# Altium schematic sheet projet_pcb_F103.SchDoc
size A3
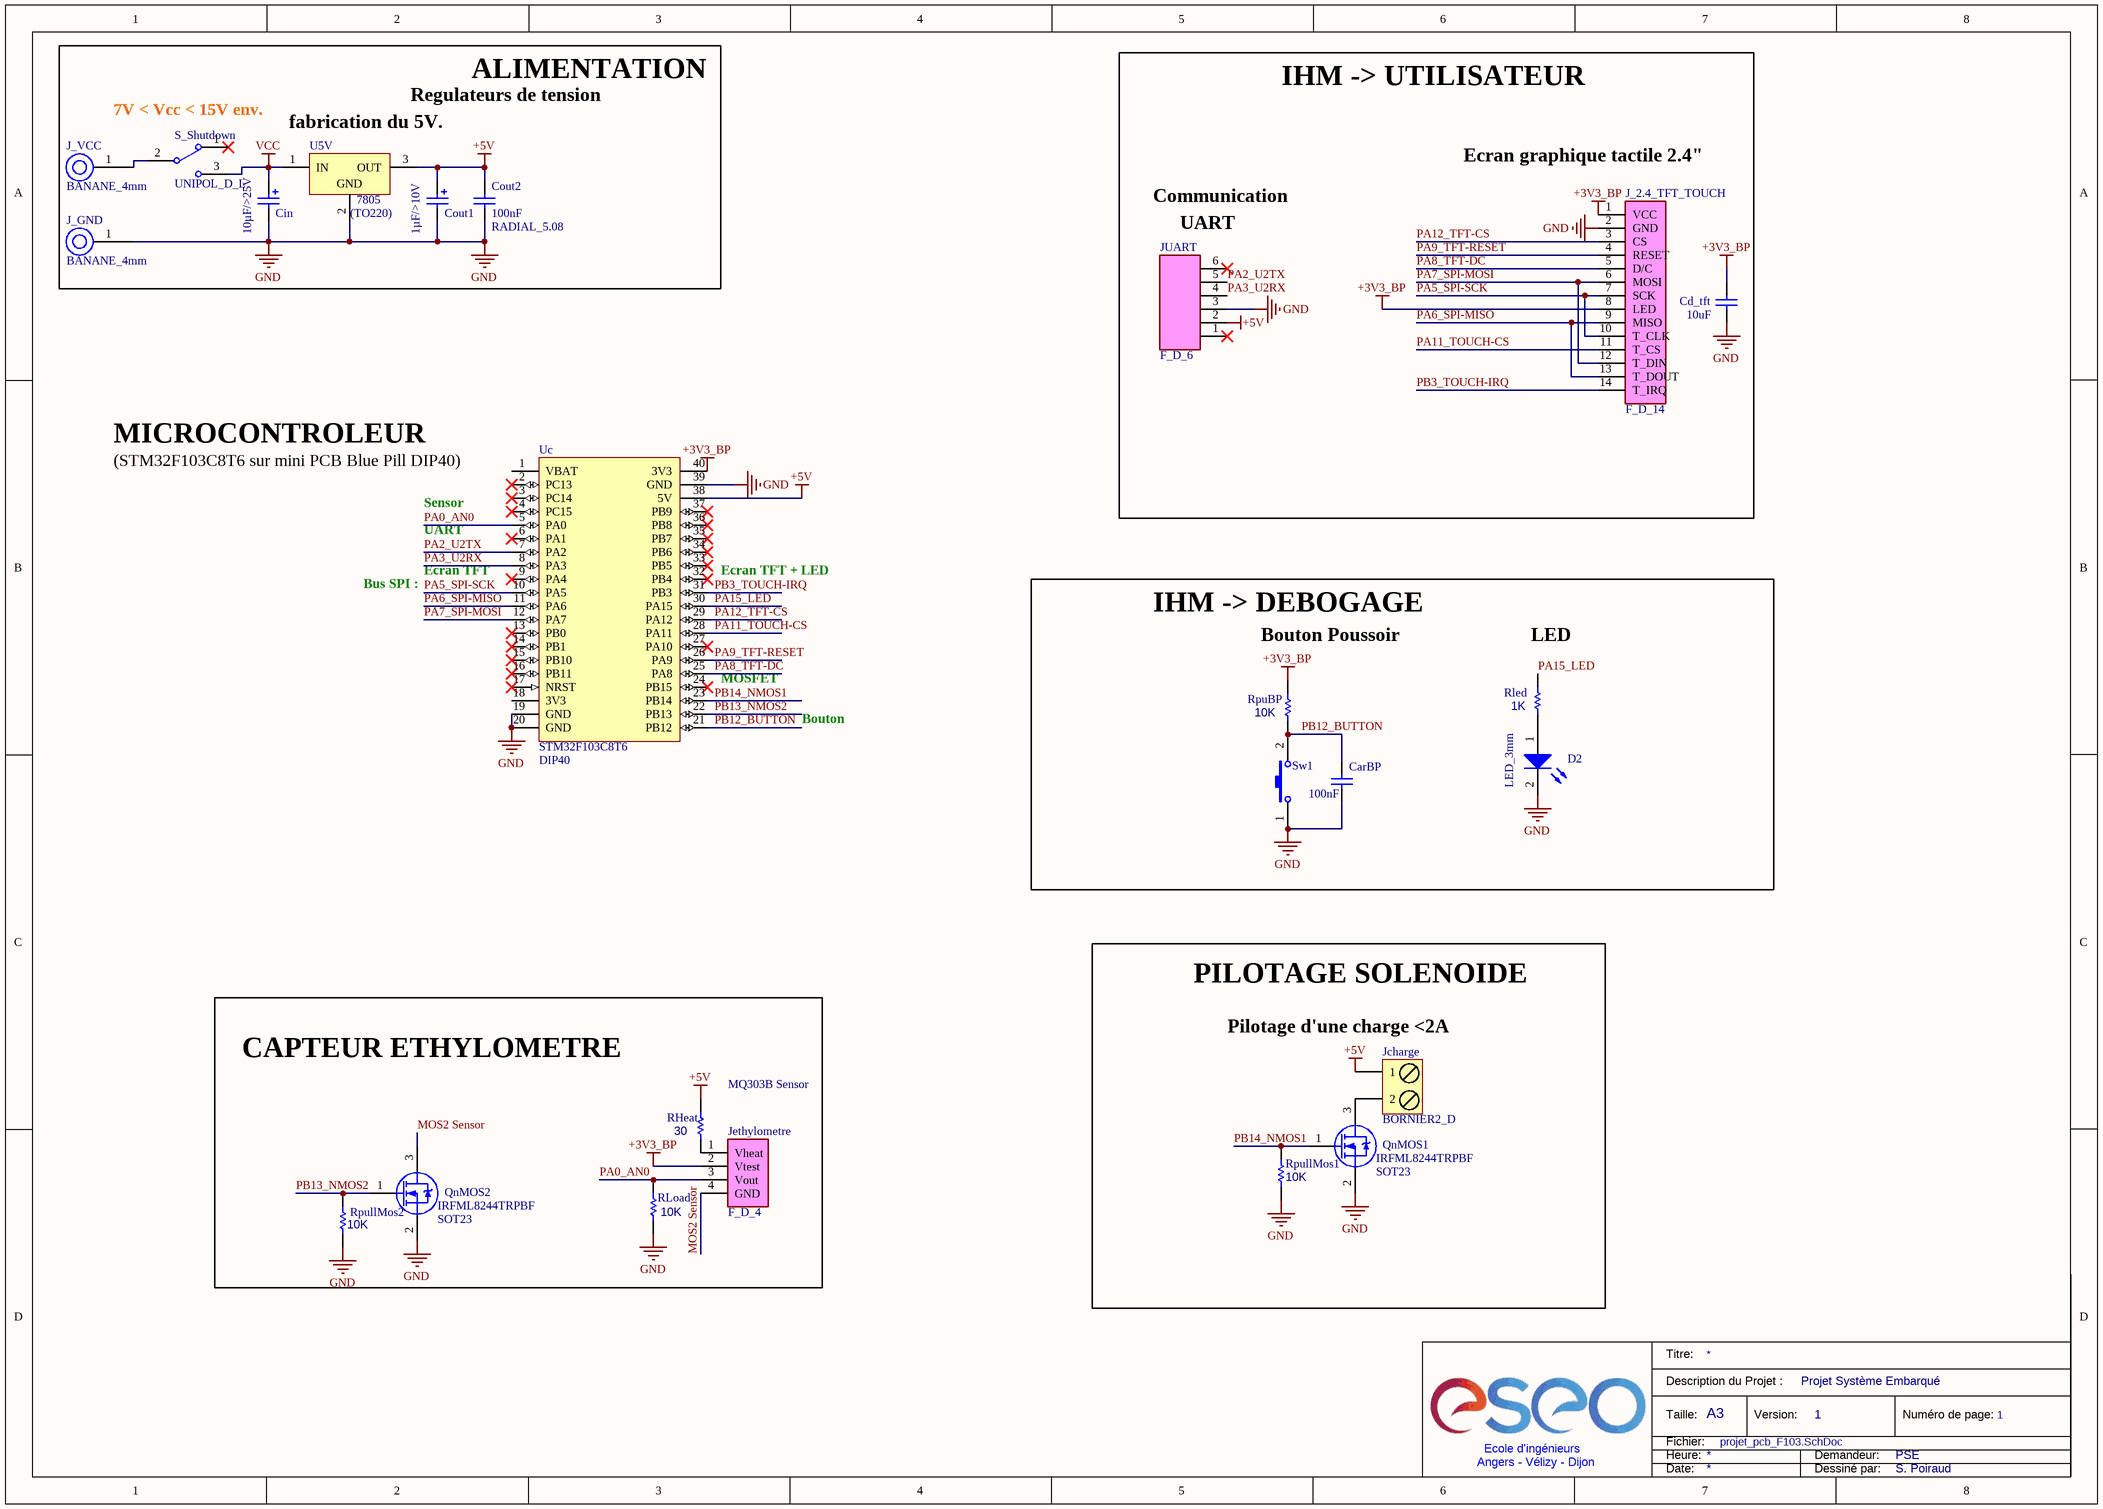
[diagram p0: projet_pcb_F103.SchDoc]

## Parts
CarBP  value 100nF  [CONDENSATEUR_CERAMIQUE_RADIAL_5.08]  (hidden comment: CONDENSATEUR_CER_RAD_5.08)
Cd_tft  10uF  [CONDENSATEUR_POLARISE_ELECTROLYTIQUE_RADIAL_2.54/5.08]
Cin  value 10µF/>25V  [CONDENSATEUR_POLARISE_ELECTROLYTIQUE_RADIAL_2.0/5.08]  (hidden comment: CONDENSATEUR_POL_ELECTROLY_RAD_2.0/5.08)
Cout1  value 1µF/>10V  [CONDENSATEUR_POLARISE_ELECTROLYTIQUE_RADIAL_2.0/5.08]  (hidden comment: CONDENSATEUR_POL_ELECTROLY_RAD_2.0/5.08)
Cout2  value 100nF  Type: RADIAL_5.08  [CONDENSATEUR_CERAMIQUE_RADIAL_5.08]  (hidden comment: CONDENSATEUR_CER_RAD_5.08)
D2  LED_3MM  [LED_3MM]
J_2.4_TFT_TOUCH  Type: F_D_14  [BARRETTE_14_F_D]  (hidden comment: BARRETTE_14 CONTACTS_1 RANGEE_FEMELLE_DROITE)
J_GND  Type: BANANE_4mm  [DOUILLE_BANANE_4mm]  (hidden comment: DOUILLE BANANE 4mm)
J_VCC  Type: BANANE_4mm  [DOUILLE_BANANE_4mm]  (hidden comment: DOUILLE BANANE 4mm)
Jcharge  Type: BORNIER2_D  [BORNIER2_A_VIS]  (hidden comment: BORNIER2 DROIT A VIS)
Jethylometre  Type: F_D_4  [BARRETTE_4_F_D]  (hidden comment: BARRETTE_4 CONTACTS_1 RANGEE_FEMELLE_DROITE)
JUART  Type: F_D_6  [BARRETTE_6_F_D]  (hidden comment: BARRETTE_6 CONTACTS_1 RANGEE_FEMELLE_DROITE)
QnMOS1  Type: IRFML8244TRPBF  Package: SOT23  [TRANSISTOR_MOSFET-N_SOT23_GSD]  (hidden comment: TRANSISTOR_MOSFET-N_SOT23_GSD)
QnMOS2  Type: IRFML8244TRPBF  Package: SOT23  [TRANSISTOR_MOSFET-N_SOT23_GSD]  (hidden comment: TRANSISTOR_MOSFET-N_SOT23_GSD)
RHeat  value 30  [RESISTANCE_1/4W]  (hidden comment: RESISTANCE_AXIALE_1/4W)
Rled  value 1K  [RESISTANCE_1/4W]  (hidden comment: RESISTANCE_AXIALE_1/4W)
RLoad  value 10K  [RESISTANCE_1/4W]  (hidden comment: RESISTANCE_AXIALE_1/4W)
RpuBP  value 10K  [RESISTANCE_1/4W]  (hidden comment: RESISTANCE_AXIALE_1/4W)
RpullMos1  value 10K  [RESISTANCE_1/4W]  (hidden comment: RESISTANCE_AXIALE_1/4W)
RpullMos2  value 10K  [RESISTANCE_1/4W]  (hidden comment: RESISTANCE_AXIALE_1/4W)
S_Shutdown  Type: UNIPOL_D_L  [INTER_UNIPOL_DROIT_LEVIER]  (hidden comment: INTERRUPTEUR_UNIPOLAIRE_DROIT_A_LEVIER)
Sw1  BOUTON_POUSSOIR_MINIATURE_TRAVERSANT  [BOUTON_POUSSE_PLAT_6x6]  (value not drawn)
U5V  Type: 7805  Package: (TO220)  [REGULATEUR_TO220_78XX]  (hidden comment: REGULATEUR_TO220_78XX)
Uc  Type: STM32F103C8T6  Package: DIP40  [STM32F103C8T6_DIP40]  (hidden comment: STM32F103C8T6/PCB_DIP40)

## Blocks framed on the sheet
ALIMENTATION: Cin Cout1 Cout2 J_GND J_VCC S_Shutdown U5V
IHM -> UTILISATEUR: Cd_tft J_2.4_TFT_TOUCH JUART
IHM -> DEBOGAGE: CarBP D2 Rled RpuBP Sw1
PILOTAGE SOLENOIDE: Jcharge QnMOS1 RpullMos1
CAPTEUR ETHYLOMETRE: Jethylometre QnMOS2 RHeat RLoad RpullMos2

## Nets
+3V3_BP: Cd_tft.1 J_2.4_TFT_TOUCH.1(VCC) J_2.4_TFT_TOUCH.8(LED) Jethylometre.2(Vtest) RpuBP.1 Uc.40(3V3)
+5V: Cout1.1 Cout2.2 Jcharge.1 JUART.2 RHeat.1 U5V.3(OUT) Uc.38(5V)
GND: CarBP.1 Cd_tft.2 Cin.2 Cout1.2 Cout2.1 D2.2 J_2.4_TFT_TOUCH.2(GND) J_GND.1 JUART.3 QnMOS1.2(S) QnMOS2.2(S) RLoad.1 RpullMos1.1 RpullMos2.1 Sw1.1 U5V.2(GND) Uc.19(GND) Uc.20(GND) Uc.39(GND)
VCC: Cin.1 S_Shutdown.3 U5V.1(IN)
MOS2 Sensor: Jethylometre.4(GND) QnMOS2.3(D)
PA0_AN0: Jethylometre.3(Vout) RLoad.2 Uc.5(PA0)
PA2_U2TX: JUART.5 Uc.7(PA2)
PA3_U2RX: JUART.4 Uc.8(PA3)
PA5_SPI-SCK: J_2.4_TFT_TOUCH.7(SCK) J_2.4_TFT_TOUCH.10(T_CLK) Uc.10(PA5)
PA6_SPI-MISO: J_2.4_TFT_TOUCH.9(MISO) J_2.4_TFT_TOUCH.13(T_DOUT) Uc.11(PA6)
PA7_SPI-MOSI: J_2.4_TFT_TOUCH.6(MOSI) J_2.4_TFT_TOUCH.12(T_DIN) Uc.12(PA7)
PA8_TFT-DC: J_2.4_TFT_TOUCH.5(D/C) Uc.25(PA8)
PA9_TFT-RESET: J_2.4_TFT_TOUCH.4(RESET) Uc.26(PA9)
PA11_TOUCH-CS: J_2.4_TFT_TOUCH.11(T_CS) Uc.28(PA11)
PA12_TFT-CS: J_2.4_TFT_TOUCH.3(CS) Uc.29(PA12)
PA15_LED: Rled.1 Uc.30(PA15)
PB3_TOUCH-IRQ: J_2.4_TFT_TOUCH.14(T_IRQ) Uc.31(PB3)
PB12_BUTTON: CarBP.2 RpuBP.2 Sw1.2 Uc.21(PB12)
PB13_NMOS2: QnMOS2.1(G) RpullMos2.2 Uc.22(PB13)
PB14_NMOS1: QnMOS1.1(G) RpullMos1.2 Uc.23(PB14)
NetD2_1: D2.1 Rled.2
NetJ_VCC_1: J_VCC.1 S_Shutdown.2
NetJcharge_2: Jcharge.2 QnMOS1.3(D)
NetJethylometre_1: Jethylometre.1(Vheat) RHeat.2

Not connected (* = marked no-connect by the designer): JUART 1* 6*; S_Shutdown 1*; Uc 1(VBAT) 2(PC13)* 3(PC14)* 4(PC15)* 6(PA1)* 9(PA4)* 13(PB0)* 14(PB1)* 15(PB10)* 16(PB11)* 17(NRST)* 18(3V3) 24(PB15)* 27(PA10)* 32(PB4)* 33(PB5)* 34(PB6)* 35(PB7)* 36(PB8)* 37(PB9)*

## Notes on the sheet
- Regulateurs de tension
- (near S_Shutdown) 7V < Vcc < 15V env.
- (near U5V) fabrication du 5V.
- (near J_2.4_TFT_TOUCH) Ecran graphique tactile 2.4"
- Communication
- (near JUART) UART
- MICROCONTROLEUR
- (near Uc) (STM32F103C8T6 sur mini PCB Blue Pill DIP40)
- Sensor
- Bus SPI :
- Ecran TFT
- UART
- (near Uc) Ecran TFT + LED
- (near RpuBP) Bouton Poussoir
- (near Rled) LED
- (near Uc) MOSFET
- Bouton
- (near Jcharge) Pilotage d'une charge <2A
- (near RHeat) MQ303B Sensor
- Titre:
- Description du Projet :
- Projet Système Embarqué
- Ecole d'ingénieurs
- Taille:
- Heure:
- Fichier:
- A3
- Version:
- 1
- Demandeur:
- PSE
- Numéro de page:
- Angers - Vélizy - Dijon
- Date:
- Dessiné par:
- S. Poiraud

## Library data of the parts
CarBP Cout2 = CONDENSATEUR_CER_RAD_5.08: CONDENSATEUR TRAVERSANT CERAMIQUE RADIAL 5.08mm
  CarBP: Type: RADIAL_5.08
Cd_tft = Condensateur: Capacitor; Published: 8-Jun-2000; LatestRevisionDate: 17-Jul-2002; LatestRevisionNote: Re-released for DXP Platform.; PackageReference: RAD-0.3; Publisher: Altium Limited
Cin Cout1 = CONDENSATEUR_POL_ELECTROLY_RAD_2.0/5.08: CONDENSATEUR POLARISE ELECTROLYTIQUE RADIAL 2.0/5.08; Type: POL_RAD_2.0/5.08
D2 = LED_3MM: LED 3MM - ROUGE/VERTE/JAUNE; Type: LED_3mm
J_GND J_VCC = DOUILLE_BANANE_4mm: DOUILLE BANANE 4 mm
Jcharge = BORNIER2_DROIT_A VIS: BORNIER 2 PLOTS DROIT A VIS 5.08mm
Jethylometre = BARRETTE_4 CONTACTS_1 RANGEE_FEMELLE_DROITE: BARRETTE 4 CONTACTS 1 RANGEE FEMELLE DROITE
JUART = BARRETTE_6 CONTACTS_1 RANGEE_FEMELLE_DROITE: BARRETTE 6 CONTACTS 1 RANGEE FEMELLE DROITE
QnMOS1 QnMOS2 = TRANSISTOR_MOSFET-N_SOT23_GSD: TRANSISTOR MOSFET CANAL N BOITIER SOT23_GSD
RHeat Rled RLoad RpuBP RpullMos1 RpullMos2 = RESISTANCE_AXIALE_1/4W: RESISTANCE TRAVERSANTE AXIALE 1/4W; Type: 1/4W
Sw1 = BOUTON_POUSSOIR_MINIATURE_TRAVERSANT: BOUTON POUSSOIR MINIATURE TRAVERSANT ON/OFF; Type: B_POUSS_MINI_T
U5V = REGULATEUR_TO220_78XX: REGULATEUR DE TENSION POSITIVE 78XX BOITIER TO220
Uc = STM32F103C8T6/PCB_DIP40: MICROCONTROLEUR 32 BITS - 72MHz - 34 I/O - 64 KO : FLASH - 20KO RAM - 10 CANAUX A/D 12 BITS - DIP40 - UART, SPI, I2C, USB, CAN